# EAGLE design MinimalDigitalAmp (EAGLE 7.5.0)
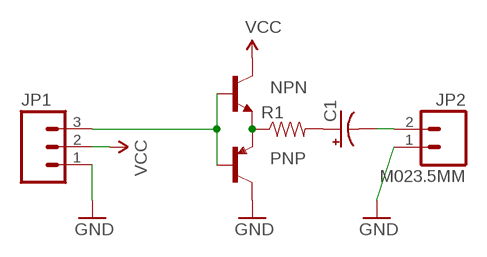
[diagram p0: schematic, sheet 1]

## Parts
C1  CAP_POLPTH1  [CPOL-RADIAL-100UF-25V]
JP1  M03PTH  [1X03]
JP2  M023.5MM  [SCREWTERMINAL-3.5MM-2]
NPN  TRANSISTOR_NPNTO-92-AMMO  [TO-92-AMMO]
PNP  TRANSISTOR_PNPAMMO  [TO-92-AMMO]
R1  RESISTORAXIAL-0.3  [AXIAL-0.3]

## Nets
GND: JP1.1 JP2.1 PNP.3(C)
N$2: C1.1(+) R1.P$2
N$3: C1.2(-) JP2.2
N$4: JP1.3 NPN.2(B) PNP.2(B)
N$5: NPN.1(E) PNP.1(E) R1.P$1
VCC: JP1.2 NPN.3(C)

## Library data of the parts
C1 = barbary_enterprises:CAP_POL: Capacitor Polarized These are standard SMD and PTH capacitors. Normally 10uF, 47uF, and 100uF in electrolytic and tantalum varieties. Always verify the external diameter of the through hole cap, it varies with capacity, voltage, and manufacturer. The EIA devices should be standard.
JP1 = SparkFun-Connectors:M03: Header 3 Standard 3-pin 0.1" header. Use with straight break away headers (SKU : PRT-00116), right angle break away headers (PRT-00553), swiss pins (PRT-00743), machine pins (PRT-00117), and female headers (PRT-00115). Molex polarized connector foot print use with SKU : PRT-08232 with associated crimp pins and housings.
JP2 = SparkFun-Connectors:M02: Standard 2-pin 0.1" header. Use with - straight break away headers ( PRT-00116) - right angle break away headers (PRT-00553) - swiss pins (PRT-00743) - machine pins (PRT-00117) - female headers (PRT-00115) Molex polarized connector foot print use with: PRT-08233 with associated crimp pins and housings. 2.54_SCREWTERM for use with PRT-10571. 3.5mm Screw Terminal footprints for PRT-08084 5mm Screw Terminal footprints for use with PRT-08433
NPN = barbary_enterprises:TRANSISTOR_NPN: Generic NPN BJT MMBT2222A - TRANS-08049 (SOT-23, 1A 40V) MPSA42 - TRANS-09116 (SOT-23, 500mA 300V) MMBT5088LT1G - TRANS-11160 (SOT-23, 50 mA 30V)
PNP = barbary_enterprises:TRANSISTOR_PNP: Generic PNP BJT Double check pinouts against datasheets- not all devices are the same! MMBT3906 - 40V 200mA SOT-23 (TRANS-08052) MMBT4403 - 40V 600mA SOT-23 (TRANS-09245)
R1 = barbary_enterprises:RESISTOR: Resistor Basic schematic elements and footprints for 0603, 1206, and PTH resistors.

## Board
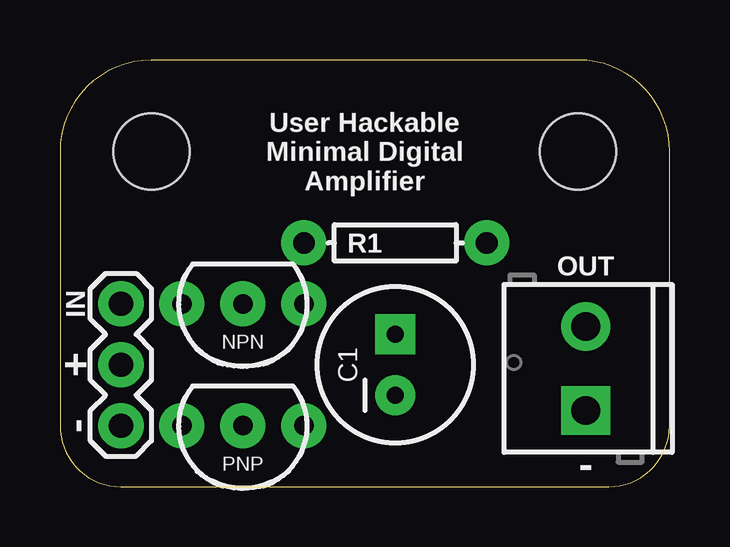
[diagram p1: board, top side]
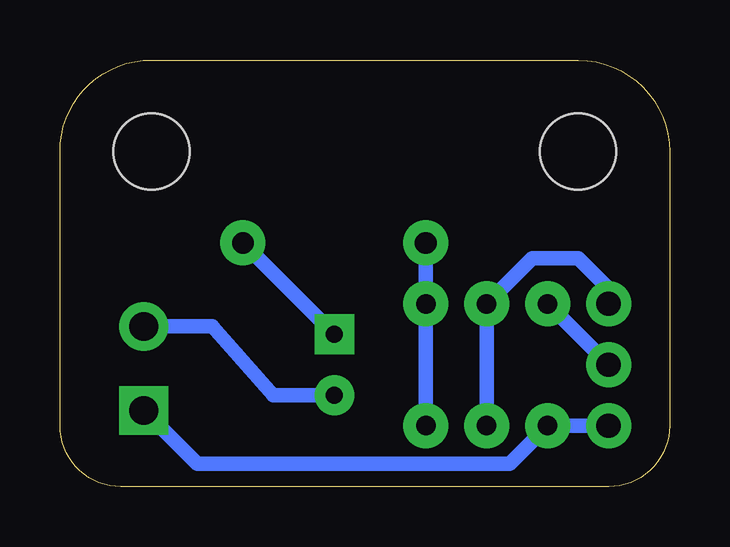
[diagram p2: board, bottom side, seen from below]

Size 25.4 x 17.78 mm. Coordinates in mm from the lower left corner, seen from the top.
Outline: 25.4,2.54 25.4,13.97 arc90 21.59,17.78 3.81,17.77 arc90 0,13.96 0,2.54 arc90 2.54,0 22.86,0 arc90 25.4,2.54
Copper layers (1*16): Top 0.035mm / dielectric 1.5mm / Bottom 0.035mm
Design rules "default": minimum track width 10mil, minimum drill 24mil, track to track 8mil, track to pad 8mil, pad to pad 8mil, via to via 8mil, smd to smd 8mil, copper to edge 40mil, drill to drill 8mil, minimum pad ring 10mil, minimum via ring 8mil, stop-mask expansion 4mil, vias tented up to drill 0mil, thermal gap 10mil
Holes 3.17 mm at 3.81,13.97 21.59,13.97

### Footprints (pad centres in the part's own frame; a part is rotated, then mirrored left to right if it is on the bottom)
CPOL-RADIAL-100UF-25V = drill 0.7 pad 1.651 square: 1 1.27,0 | drill 0.7 pad 1.651: 2 -1.27,0
1X03 = drill 1.016 pad 1.88: 1 0,0; 2 2.54,0; 3 5.08,0
SCREWTERMINAL-3.5MM-2 = drill 1.2 pad 2.032 square: 1 0,0 | drill 1.2 pad 2.032: 2 3.5,0
TO-92-AMMO = drill 0.813 pad 1.88: 1 -2.54,0; 2 0,0; 3 2.54,0
AXIAL-0.3 = drill 0.9 pad 1.88: P$1 -3.81,0; P$2 3.81,0

### Placement (x,y rotation side)
C1  13.97,5.08 90 top
JP1  2.54,2.54 90 top
JP2  21.91,3.17 90 top
NPN  7.62,7.62 180 top
PNP  7.62,2.54 180 top
R1  13.97,10.16 0 top

### Tracks (layer width: path | path; a pad name or v marks a point on that pad's centre or on a via)
GND
  Bottom 0.61: JP1.1 PNP.3 6.67,0.95 19.68,0.95 JP2.1
N$2
  Bottom 0.61: C1.1 R1.P$2
N$3
  Bottom 0.61: C1.2 16.51,3.81 19.06,6.67 JP2.2
N$4
  Bottom 0.61: JP1.3 2.54,8.26 3.81,9.53 5.71,9.53 NPN.2 PNP.2
N$5
  Bottom 0.61: PNP.1 NPN.1 R1.P$1
VCC
  Bottom 0.61: JP1.2 NPN.3

### Text on the board
tPlace: User Hackable / Minimal Digital / Amplifier | OUT | IN | + | - | -